# Altium project BMS.PrjPcb
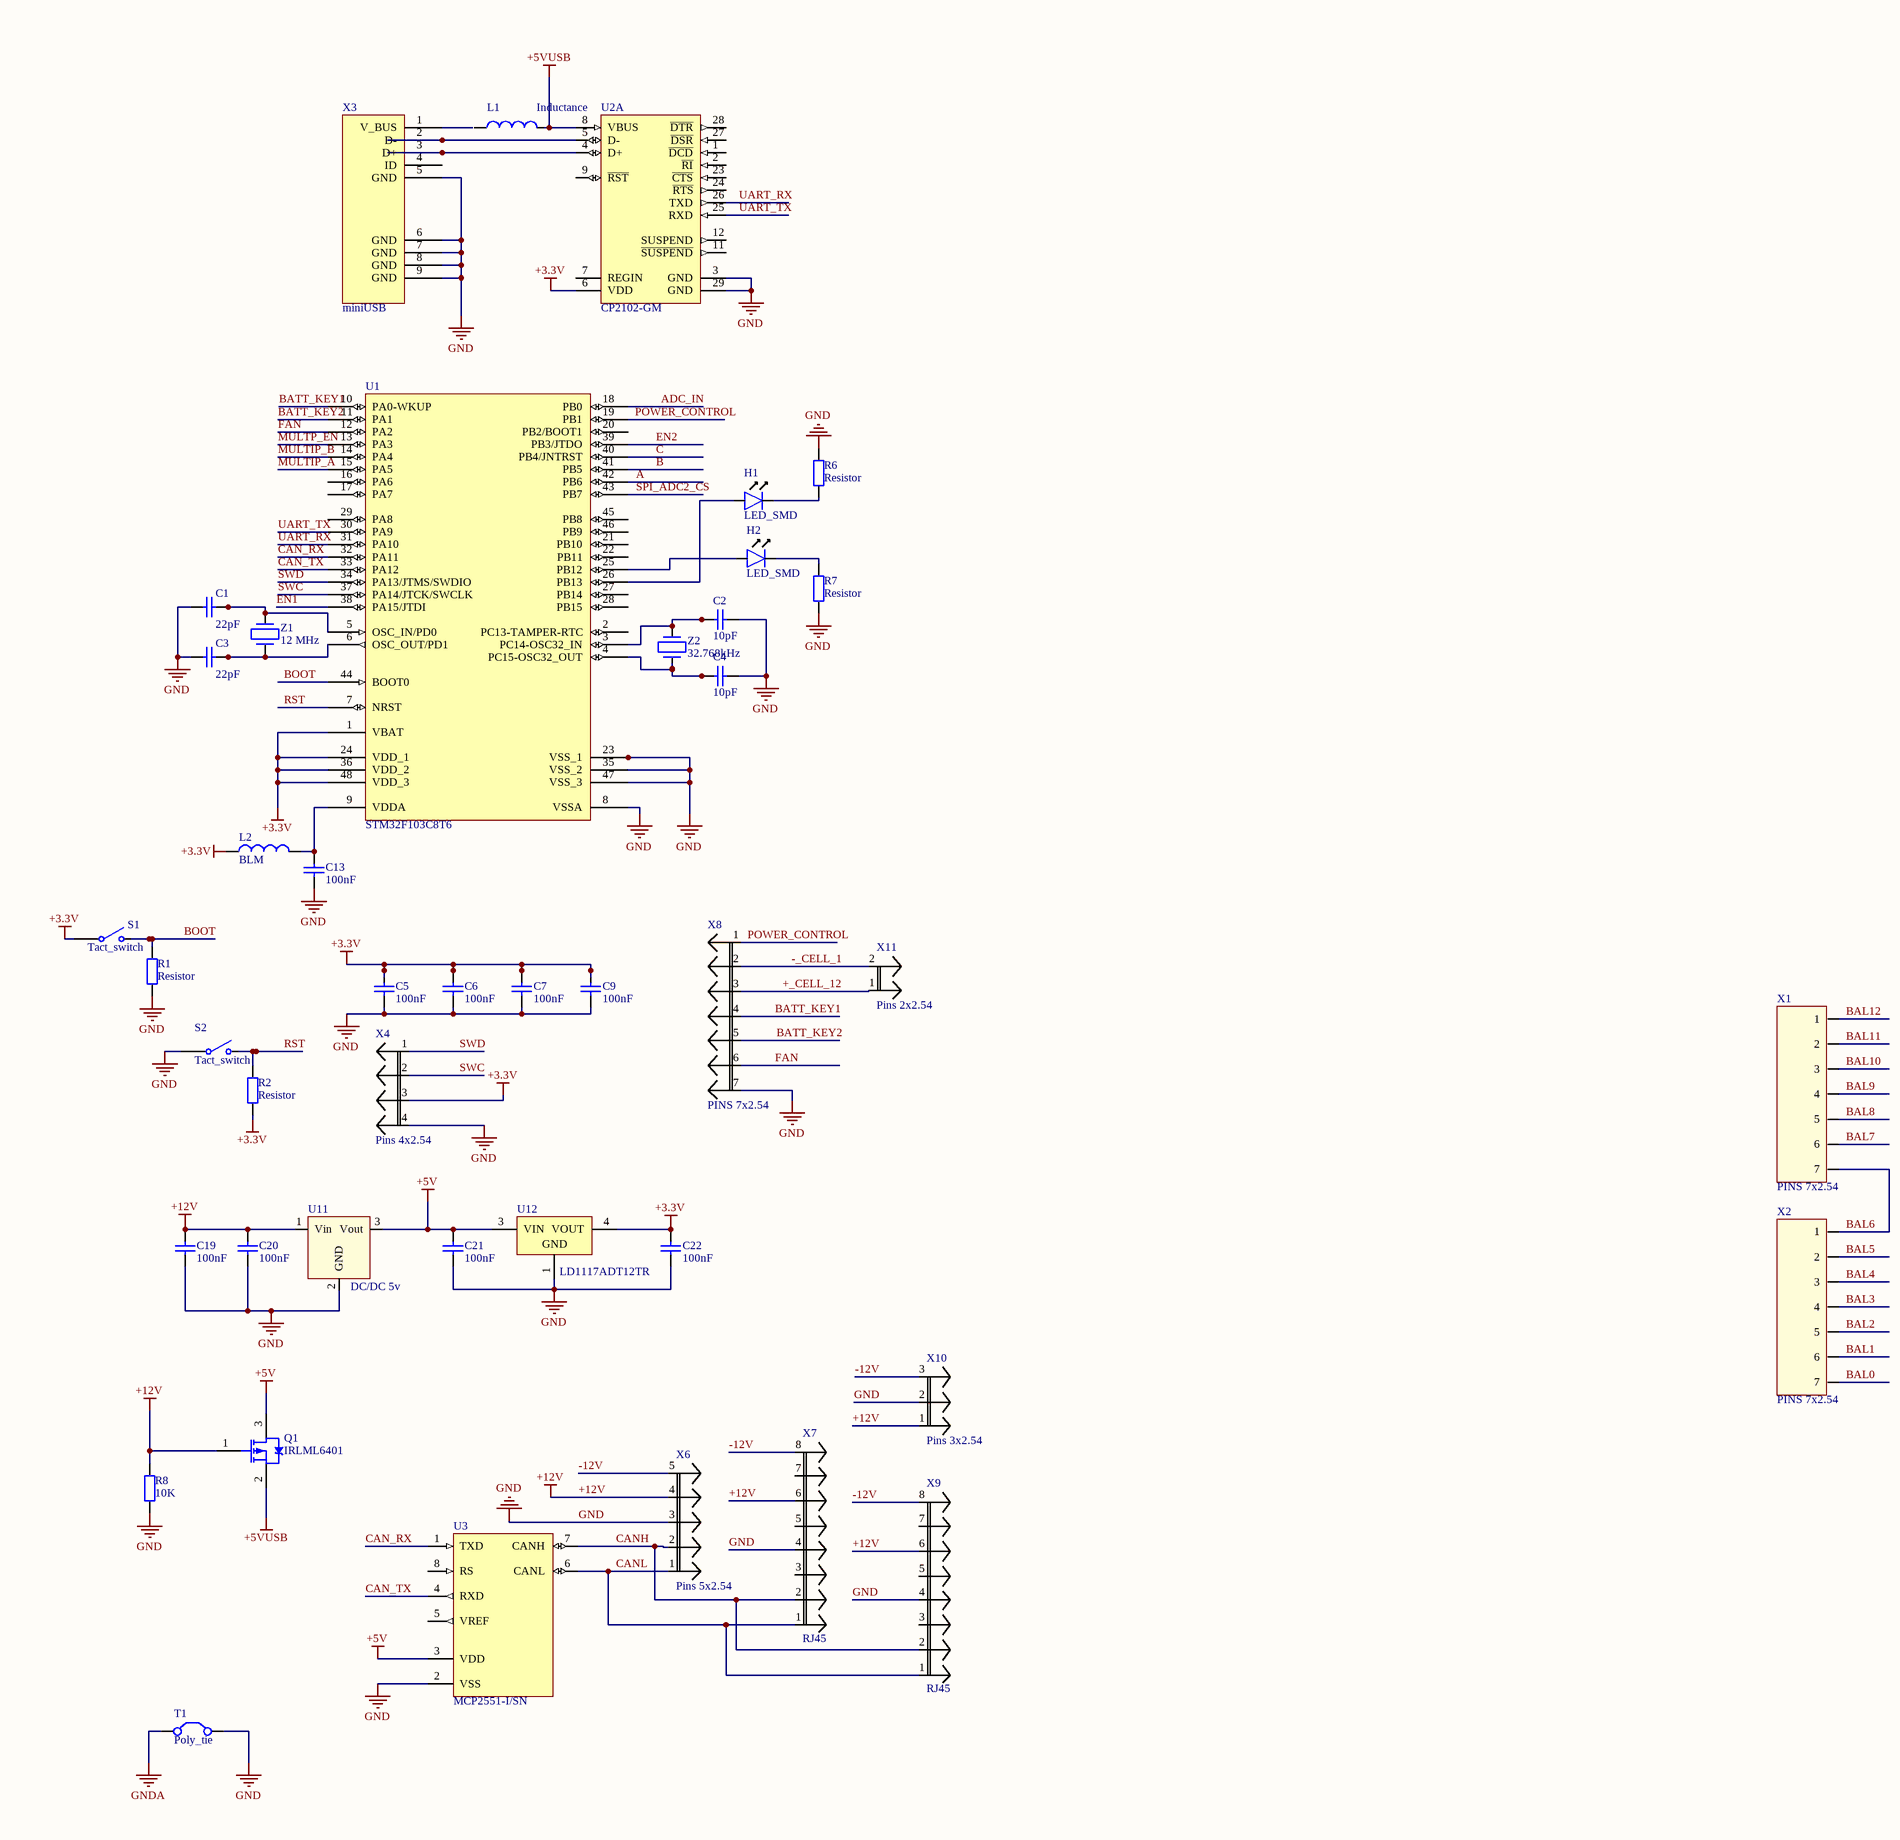
[diagram p0: BMS_main.SchDoc, left]
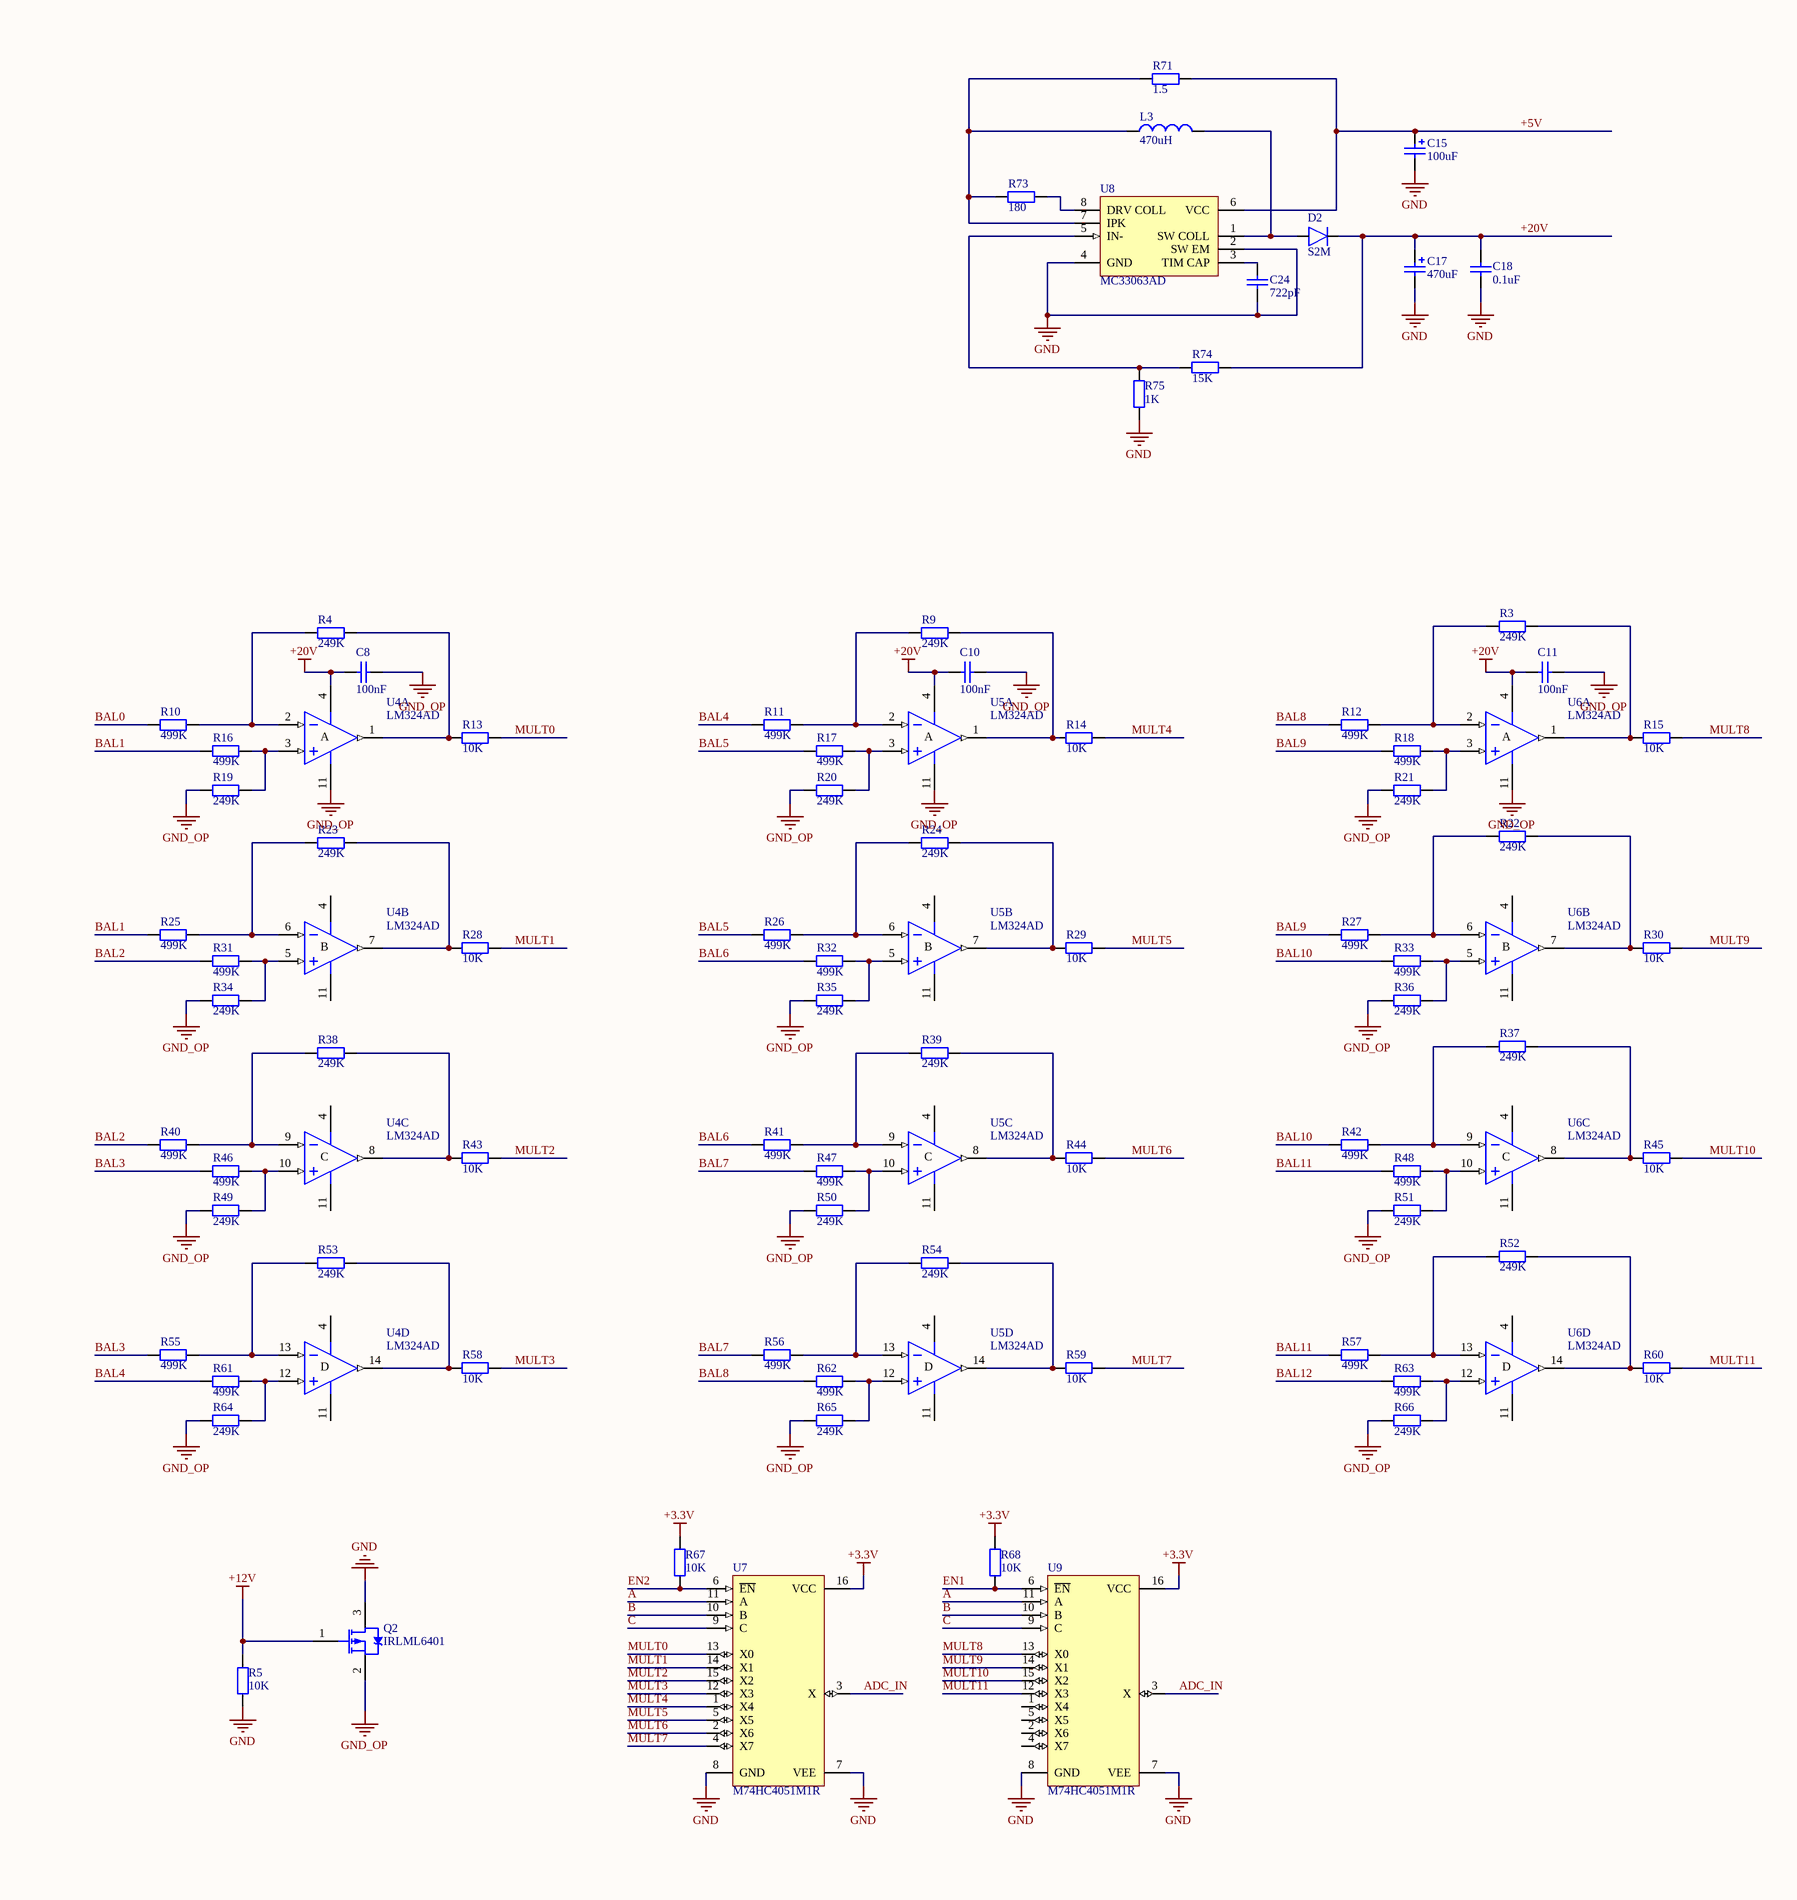
[diagram p1: BMS_main.SchDoc, right]
1 sheet, 126 parts. Net scope: global (net labels, ports and power ports of the same name join across sheets).
Board file: BMS_main.PcbDoc

## Sheet BMS_main.SchDoc
size A1

### Parts
C1  22pF  [C0805]
C2  10pF  [C0805]
C3  22pF  [C0805]
C4  10pF  [C0805]
C5  100nF  [C0805]
C6  100nF  [C0805]
C7  100nF  [C0805]
C8  100nF  [C0805]
C9  100nF  [C0805]
C10  100nF  [C0805]
C11  100nF  [C0805]
C13  100nF  [C0805]
C15  100uF  [CAP_EL_SMD_6.3mm]
C17  470uF  [Cap_El_SMD_10mm]
C18  0.1uF  [C0805]
C19  100nF  [C0805]
C20  100nF  [C0805]
C21  100nF  [C0805]
C22  100nF  [C0805]
C24  722pF  [C0805]
D2  S2M  [SMB_DIODE]
H1  LED_SMD  [C0805]
H2  LED_SMD  [C0805]
L1  Inductance  [L0805]
L2  BLM  [L0805]
L3  470uH  [L1812]
Q1  IRLML6401  [sot-23]
Q2  IRLML6401  [sot-23]
R1  Resistor  [R0805]
R2  Resistor  [R0805]
R3  249K  [R0805]
R4  249K  [R0805]
R5  10K  [R0805]
R6  Resistor  [R0805]
R7  Resistor  [R0805]
R8  10K  [R0805]
R9  249K  [R0805]
R10  499K  [R0805]
R11  499K  [R0805]
R12  499K  [R0805]
R13  10K  [R0805]
R14  10K  [R0805]
R15  10K  [R0805]
R16  499K  [R0805]
R17  499K  [R0805]
R18  499K  [R0805]
R19  249K  [R0805]
R20  249K  [R0805]
R21  249K  [R0805]
R22  249K  [R0805]
R23  249K  [R0805]
R24  249K  [R0805]
R25  499K  [R0805]
R26  499K  [R0805]
R27  499K  [R0805]
R28  10K  [R0805]
R29  10K  [R0805]
R30  10K  [R0805]
R31  499K  [R0805]
R32  499K  [R0805]
R33  499K  [R0805]
R34  249K  [R0805]
R35  249K  [R0805]
R36  249K  [R0805]
R37  249K  [R0805]
R38  249K  [R0805]
R39  249K  [R0805]
R40  499K  [R0805]
R41  499K  [R0805]
R42  499K  [R0805]
R43  10K  [R0805]
R44  10K  [R0805]
R45  10K  [R0805]
R46  499K  [R0805]
R47  499K  [R0805]
R48  499K  [R0805]
R49  249K  [R0805]
R50  249K  [R0805]
R51  249K  [R0805]
R52  249K  [R0805]
R53  249K  [R0805]
R54  249K  [R0805]
R55  499K  [R0805]
R56  499K  [R0805]
R57  499K  [R0805]
R58  10K  [R0805]
R59  10K  [R0805]
R60  10K  [R0805]
R61  499K  [R0805]
R62  499K  [R0805]
R63  499K  [R0805]
R64  249K  [R0805]
R65  249K  [R0805]
R66  249K  [R0805]
R67  10K  [R0805]
R68  10K  [R0805]
R71  1.5  [R0805]
R73  180  [R0805]
R74  15K  [R0805]
R75  1K  [R0805]
S1  Tact_switch  [Tact_switch_smd]
S2  Tact_switch  [Tact_switch_smd]
T1  Poly_tie  [Poly_tie_5x5]
U1  STM32F103C8T6  [LQFP48_N]
U2  CP2102-GM  [SLAB-QFN-28-3125x3125TP_N]  (part A of 2)
U3  MCP2551-I/SN  [SOIC-SN8_N]
U4  LM324AD  [SO14_N]  (parts A,B,C,D of 4)
U5  LM324AD  [SO14_N]  (parts A,B,C,D of 4)
U6  LM324AD  [SO14_N]  (parts A,B,C,D of 4)
U7  M74HC4051M1R  [SO16_N]
U8  MC33063AD  [751-05_N]
U9  M74HC4051M1R  [SO16_N]
U11  DC/DC 5v  [DC/DC R-78E]
U12  LD1117ADT12TR  [TO-252_N]
X1  PINS 7x2.54  [PINS 7X2.54]
X2  PINS 7x2.54  [PINS 7X2.54]
X3  miniUSB  [miniUSB]
X4  Pins 4x2.54  [Pins 4x2.54]
X6  Pins 5x2.54  [Pins 5x2.54]
X7  RJ45  [RJ45]
X8  PINS 7x2.54  [PINS 7X2.54]
X9  RJ45  [RJ45]
X10  Pins 3x2.54  [Pins 3x2.54]
X11  Pins 2x2.54  [Pins 2x2.54]
Z1  12 MHz  [kx 13 12MHz]
Z2  32.768kHz  [Geyer KX - 327S 32.768kHz]

### Nets
+3.3V: C5.2 C6.2 C7.2 C9.2 C22.2 L2.1 R2.1 R67.2 R68.2 S1.1(COMMON) U1.1(VBAT) U1.24(VDD_1) U1.36(VDD_2) U1.48(VDD_3) U2.6(VDD) U7.16(VCC) U9.16(VCC) U12.4(VOUT) X4.3
+5V: C15.1 C21.2 Q1.3(D) R71.1 U3.3(VDD) U8.6(VCC) U11.3(Vout) U12.3(VIN)
+5VUSB: L1.2 Q1.2(S) U2.8(VBUS)
+12V: C19.2 C20.2 Q1.1(G) Q2.1(G) R5.2 R8.2 U11.1(Vin) X6.4 X7.6 X9.6 X10.1
+20V: C8.1 C10.1 C11.1 C17.1 C18.2 D2.2 R74.2 U4.4(V+) U5.4(V+) U6.4(V+)
GND: C1.1 C2.1 C3.1 C4.1 C5.1 C6.1 C7.1 C9.1 C13.1 C15.2 C17.2 C18.1 C19.1 C20.1 C21.1 C22.1 C24.1 Q2.3(D) R1.1 R5.1 R6.2 R7.1 R8.1 R75.1 S2.1(COMMON) T1.2(C2) U1.8(VSSA) U1.23(VSS_1) U1.35(VSS_2) U1.47(VSS_3) U2.3(GND) U2.29(GND) U3.2(VSS) U7.7(VEE) U7.8(GND) U8.2(SW_EM) U8.4(GND) U9.7(VEE) U9.8(GND) U11.2(GND) U12.1(GND) X3.5(GND) X3.6(GND) X3.7(GND) X3.8(GND) X3.9(GND) X4.4 X6.3 X7.4 X8.7 X9.4 X10.2
GND_OP: C8.2 C10.2 C11.2 Q2.2(S) R19.1 R20.1 R21.1 R34.1 R35.1 R36.1 R49.1 R50.1 R51.1 R64.1 R65.1 R66.1 U4.11(V-) U5.11(V-) U6.11(V-)
GNDA: T1.1(C1)
+_CELL_12: X8.3 X11.1
-12V: X6.5 X7.8 X9.8 X10.3
-_CELL_1: X8.2 X11.2
A: U1.42(PB6) U7.11(A) U9.11(A)
ADC_IN: U1.18(PB0) U7.3(X) U9.3(X)
B: U1.41(PB5) U7.10(B) U9.10(B)
BAL0: R10.1 X2.7
BAL1: R16.1 R25.1 X2.6
BAL2: R31.1 R40.1 X2.5
BAL3: R46.1 R55.1 X2.4
BAL4: R11.1 R61.1 X2.3
BAL5: R17.1 R26.1 X2.2
BAL6: R32.1 R41.1 X1.7 X2.1
BAL7: R47.1 R56.1 X1.6
BAL8: R12.1 R62.1 X1.5
BAL9: R18.1 R27.1 X1.4
BAL10: R33.1 R42.1 X1.3
BAL11: R48.1 R57.1 X1.2
BAL12: R63.1 X1.1
BATT_KEY1: U1.10(PA0-WKUP) X8.4
BATT_KEY2: U1.11(PA1) X8.5
BOOT: R1.2 S1.2(NO) U1.44(BOOT0)
C: U1.40(PB4/JNTRST) U7.9(C) U9.9(C)
CAN_RX: U1.32(PA11) U3.1(TXD)
CAN_TX: U1.33(PA12) U3.4(RXD)
CANH: U3.7(CANH) X6.2 X7.2 X9.2
CANL: U3.6(CANL) X6.1 X7.1 X9.1
EN1: R68.1 U1.38(PA15/JTDI) U9.6(~{EN})
EN2: R67.1 U1.39(PB3/JTDO) U7.6(~{EN})
FAN: U1.12(PA2) X8.6
MULT0: R13.2 U7.13(X0)
MULT1: R28.2 U7.14(X1)
MULT2: R43.2 U7.15(X2)
MULT3: R58.2 U7.12(X3)
MULT4: R14.2 U7.1(X4)
MULT5: R29.2 U7.5(X5)
MULT6: R44.2 U7.2(X6)
MULT7: R59.2 U7.4(X7)
MULT8: R15.2 U9.13(X0)
MULT9: R30.2 U9.14(X1)
MULT10: R45.2 U9.15(X2)
MULT11: R60.2 U9.12(X3)
MULTIP_A: U1.15(PA5)
MULTIP_B: U1.14(PA4)
MULTP_EN: U1.13(PA3)
POWER_CONTROL: U1.19(PB1) X8.1
RST: R2.2 S2.2(NO) U1.7(NRST)
SPI_ADC2_CS: U1.43(PB7)
SWC: U1.37(PA14/JTCK/SWCLK) X4.2
SWD: U1.34(PA13/JTMS/SWDIO) X4.1
UART_RX: U1.31(PA10) U2.26(TXD)
UART_TX: U1.30(PA9) U2.25(RXD)
NetC1_2: C1.2 U1.5(OSC_IN/PD0) Z1.1
NetC2_2: C2.2 U1.3(PC14-OSC32_IN) Z2.1
NetC3_2: C3.2 U1.6(OSC_OUT/PD1) Z1.3
NetC4_2: C4.2 U1.4(PC15-OSC32_OUT) Z2.2
NetC13_2: C13.2 L2.2 U1.9(VDDA)
NetC24_2: C24.2 U8.3(TIM_CAP)
NetD2_1: D2.1 L3.2 U8.1(SW_COLL)
NetH1_1: H1.1 U1.26(PB13)
NetH1_2: H1.2 R6.1
NetH2_1: H2.1 U1.25(PB12)
NetH2_2: H2.2 R7.2
NetL3_1: L3.1 R71.2 R73.2 U8.7(IPK)
NetR3_1: R3.1 R12.2 U6.2(IN-)
NetR3_2: R3.2 R15.1 U6.1(OUT)
NetR4_1: R4.1 R10.2 U4.2(IN-)
NetR4_2: R4.2 R13.1 U4.1(OUT)
NetR9_1: R9.1 R11.2 U5.2(IN-)
NetR9_2: R9.2 R14.1 U5.1(OUT)
NetR16_2: R16.2 R19.2 U4.3(IN+)
NetR17_2: R17.2 R20.2 U5.3(IN+)
NetR18_2: R18.2 R21.2 U6.3(IN+)
NetR22_1: R22.1 R27.2 U6.6(IN-)
NetR22_2: R22.2 R30.1 U6.7(OUT)
NetR23_1: R23.1 R25.2 U4.6(IN-)
NetR23_2: R23.2 R28.1 U4.7(OUT)
NetR24_1: R24.1 R26.2 U5.6(IN-)
NetR24_2: R24.2 R29.1 U5.7(OUT)
NetR31_2: R31.2 R34.2 U4.5(IN+)
NetR32_2: R32.2 R35.2 U5.5(IN+)
NetR33_2: R33.2 R36.2 U6.5(IN+)
NetR37_1: R37.1 R42.2 U6.9(IN-)
NetR37_2: R37.2 R45.1 U6.8(OUT)
NetR38_1: R38.1 R40.2 U4.9(IN-)
NetR38_2: R38.2 R43.1 U4.8(OUT)
NetR39_1: R39.1 R41.2 U5.9(IN-)
NetR39_2: R39.2 R44.1 U5.8(OUT)
NetR46_2: R46.2 R49.2 U4.10(IN+)
NetR47_2: R47.2 R50.2 U5.10(IN+)
NetR48_2: R48.2 R51.2 U6.10(IN+)
NetR52_1: R52.1 R57.2 U6.13(IN-)
NetR52_2: R52.2 R60.1 U6.14(OUT)
NetR53_1: R53.1 R55.2 U4.13(IN-)
NetR53_2: R53.2 R58.1 U4.14(OUT)
NetR54_1: R54.1 R56.2 U5.13(IN-)
NetR54_2: R54.2 R59.1 U5.14(OUT)
NetR61_2: R61.2 R64.2 U4.12(IN+)
NetR62_2: R62.2 R65.2 U5.12(IN+)
NetR63_2: R63.2 R66.2 U6.12(IN+)
NetR73_1: R73.1 U8.8(DRV_COLL)
NetR74_1: R74.1 R75.2 U8.5(IN-)
NetU2_4: U2.4(D+) X3.3(D+)
NetU2_5: U2.5(D-) X3.2(D-)

Not connected (* = marked no-connect by the designer): L1 1; U1 2(PC13-TAMPER-RTC) 16(PA6) 17(PA7) 20(PB2/BOOT1) 21(PB10) 22(PB11) 27(PB14) 28(PB15) 29(PA8) 45(PB8) 46(PB9); U2 1(~{DCD}) 2(~{RI}) 7(REGIN) 9(~{RST}) 11(~{SUSPEND}) 12(SUSPEND) 23(~{CTS}) 24(~{RTS}) 27(~{DSR}) 28(~{DTR}); U3 5(VREF) 8(RS); U9 1(X4) 2(X6) 4(X7) 5(X5); X3 1(V_BUS) 4(ID); X7 3 5 7; X9 3 5 7

### Notes on the sheet
- (in symbol LM324AD, part A) A
- (in symbol LM324AD, part B) B
- (in symbol LM324AD, part C) C
- (in symbol LM324AD, part D) D

### Library data of the parts
C1-C11 C13 C18-C22 C24 = Condensator
C15 C17 = Cond_polar
D2 = Diod
L2 L3 = Inductance
R3-R5 R8-R68 R71 R73-R75 = Resistor
U1 = STM32F103C8T6: STM32 ARM-based 32-bit MCU with 64 Kbytes Flash, 48-pin LQFP, Industrial Temperature; Published: 30-May-2008; DatasheetVersion: rev6, Mar-2008; PackageVersion: Mar-2008; PackageReference: LQFP48; Publisher: Altium Limited; PackageDescription: 48-Pin Low-Profile Quad Flat Pack, 7 x 7 mm Body, 0.5 mm Pitch (LQFP48); ComponentLink1Description: Manufacturer Link; ComponentLink1URL: www.st.com/stm32; ComponentLink2Description: Datasheet; ComponentLink2URL: http://www.st.com/stonline/products/literature/ds/13587.pdf
U2 = CP2102-GM: Single-Chip USB to UART Bridge, 1024 Bytes EEPROM, -40 to 85 degC, 28-pin QFN, Tube; Manufacturer: Silicon Labs; Internal Oscillator: TRUE; Sub-Family: USB Bridges; DatasheetVersion: Rev. 1.5; PackageReference: QFN-28; PackageDescription: 28-Pin Quad-Flat No-Leads Package, Body 5 x 5 mm, Pitch 0.5 mm; Supplier 1: Digi-Key; Supplier Part Number 1: 336-1160-5-ND; Supplier 2: Farnell; Supplier Part Number 2: 9282130; Supplier 3: Newark; Supplier Part Number 3: 30K5635; Supplier 4: Mouser; Supplier Part Number 4: 634-CP2102-GM; EEPROM: 1024 Bytes; Mounting Technology: Surface Mount; Code_JEDEC: MO-220; Code_IPC: J-STD-020C; PartNumber: CP2102-GM; ComponentLink1Description: Manufacturer URL; ComponentLink1URL: http://www.silabs.com/; ComponentLink2Description: Datasheet; ComponentLink2URL: http://www.silabs.com/Support%20Documents/TechnicalDocs/CP2102-9.pdf; ComponentLink3Description: Package Specification; ComponentLink3URL: http://www.silabs.com/Support%20Documents/TechnicalDocs/C8051T61x.pdf
U3 = MCP2551-I/SN: High-Speed CAN Transceiver, 8-Pin SOIC, Industrial Temperature; Published: 29-Jan-2009; DatasheetVersion: revE, Jan-2007; PackageVersion: revBB, Aug-2009; PackageReference: SOIC-SN8; Publisher: Altium Limited; PackageDescription: 8-Lead Plastic Small Outline (SN) - Narrow, 3.90mm Body [SOIC]; Supplier 1: Digi-Key; Supplier Part Number 1: MCP2551-I/SN-ND; Supplier 2: Farnell; Supplier Part Number 2: 9758569; Code_JEDEC: MS-012; Code_IPC: SOIC127P600-8; ComponentLink1Description: Datasheet; ComponentLink1URL: http://ww1.microchip.com/downloads/en/DeviceDoc/21667E.pdf; ComponentLink2Description: Packaging Specification; ComponentLink2URL: http://www.microchip.com/stellent/groups/techpub_sg/documents/packagingspec/en012702.pdf; ComponentLink3Description: Microchip.com Home; ComponentLink3URL: http://www.microchip.com/
U4-U6 = LM324AD: Low-Power Quad Operational Amplifier; Published: 24-Aug-2001; LatestRevisionDate: 13-Apr-2006; LatestRevisionNote: IPC-7351 Footprint Added.; DatasheetVersion: Nov-1997; PackageVersion: Sep-1998; PackageReference: SO14; Publisher: Altium Limited; PackageDescription: 14-Pin Small Outline Integrated Circuit 1.27 mm Pitch; Code_IPC: SOIC127P600-14; ComponentLink1Description: Manufacturer Link; ComponentLink1URL: http://www.st.com/; ComponentLink2Description: Datasheet; ComponentLink2URL: http://www.st.com/stonline/products/literature/ds/4797/lm224a.pdf
U7 U9 = M74HC4051M1R: Analog Multiplexer/Demultiplexer Single 8-Channel; Published: 8-Jun-2000; LatestRevisionDate: 13-Apr-2006; LatestRevisionNote: IPC-7351 Footprint Added.; DatasheetVersion: Oct-1993; PackageVersion: May-1998; PackageReference: SO16; Publisher: Altium Limited; PackageDescription: 16-Pin Small Outline Integrated Circuit 1.27 mm Pitch; Code_IPC: SOIC127P600-16; ComponentLink1Description: Manufacturer Link; ComponentLink1URL: http://www.st.com/; ComponentLink2Description: Datasheet; ComponentLink2URL: http://www.st.com/stonline/products/literature/ds/1966/m74hc4051.pdf
U8 = MC33063AD: DC-to-DC Converter Control Circuit; Published: 15-Apr-2002; LatestRevisionDate: 13-Apr-2006; LatestRevisionNote: IPC-7351 Footprint Added.; DatasheetVersion: 1996; PackageVersion: 1998; PackageReference: 751-05; Publisher: Altium Limited; PackageDescription: 8-Pin Small Outline Integrated Circuit 1.27 mm Pitch; Code_JEDEC: MS-012-AA; Code_IPC: SOIC127P600-8; ComponentLink1Description: Manufacturer Link; ComponentLink1URL: http://www.onsemi.com/site/products/taxonomy/0,4438,503,00.html; ComponentLink2Description: Datasheet; ComponentLink2URL: http://www.onsemi.com/pub/Collateral/MC34063A-D.PDF
U11 = DC/DC R-78E
U12 = LD1117ADT12TR: 1A, Low Drop Positive Voltage Regulator, 1.2V, 3-Pin DPAK, Tape and Reel; DatasheetVersion: Dec-2011; PackageVersion: 2011; PackageReference: TO-252; PackageDescription: 3-Pin Transistor Outline Package 2.28 mm Pitch, 9.7 mm Lead Span (DPAK); PartNumber: LD1117ADT12TR; ComponentLink1Description: Manufacturer URL; ComponentLink1URL: http://www.st.com; ComponentLink2Description: Datasheet; ComponentLink2URL: http://www.st.com/internet/com/TECHNICAL_RESOURCES/TECHNICAL_LITERATURE/DATASHEET/CD00002116.pdf
Z1 = KX 13 Geyer
Z2 = Crystal Oscillator